# Altium schematic sheet ADC.SchDoc
size A4
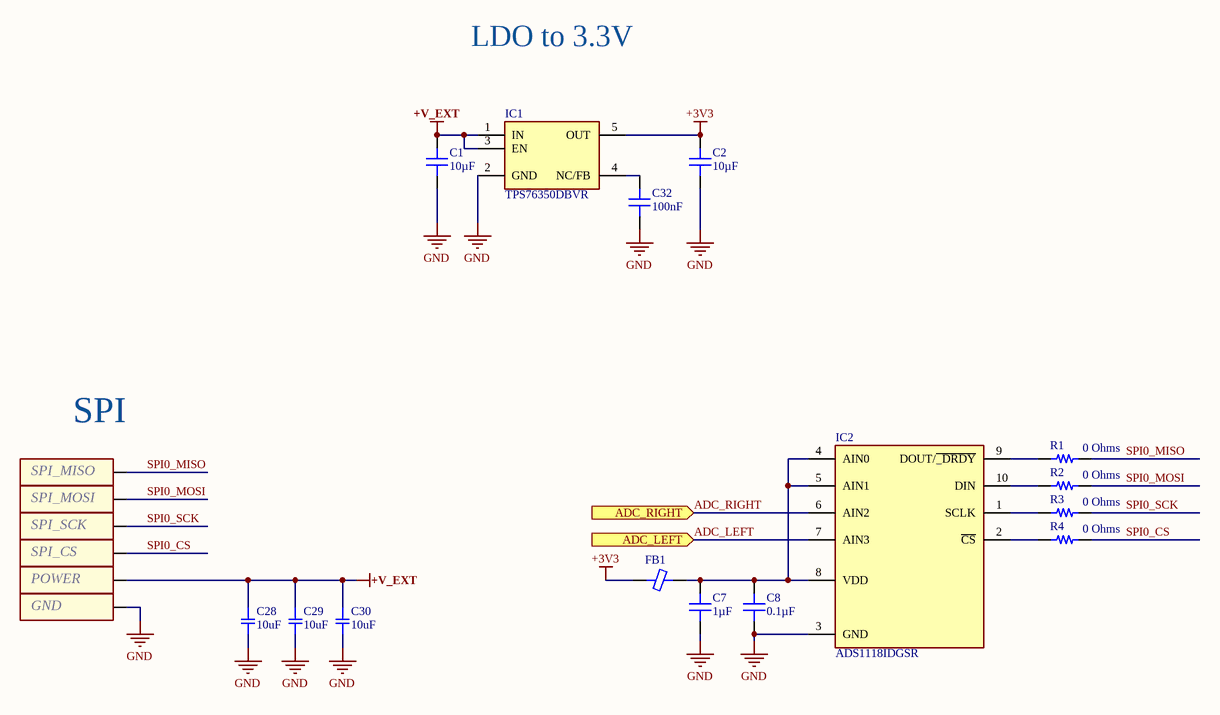
[diagram p0: ADC.SchDoc]

## Parts
C1  10µF  [CAP 0603_1608]
C2  10µF  [CAP 0603_1608]
C7  1µF  [CAP 0603_1608]
C8  0.1µF  [CAP 0603_1608]
C28  10uF  [SMD-0805C]
C29  10uF  [SMD-0805C]
C30  10uF  [SMD-0805C]
C32  100nF  [CAP 0603_1608]
FB1  (no value)  [FER 0603_1608]
IC1  TPS76350DBVR  [SOT95P280X145-5N]
IC2  ADS1118IDGSR  [SOP50P490X110-10N]
R1  0 Ohms  [RES 0603_1608]
R2  0 Ohms  [RES 0603_1608]
R3  0 Ohms  [RES 0603_1608]
R4  0 Ohms  [RES 0603_1608]
X1  SPI_MISO  [PLS-1]  (no BOM)
X2  Name: SPI_MOSI  [PLS-1]  (hidden comment: SPI_MISO)  (no BOM)
X3  Name: SPI_SCK  [PLS-1]  (hidden comment: SPI_MISO)  (no BOM)
X4  Name: SPI_CS  [PLS-1]  (hidden comment: SPI_MISO)  (no BOM)
X5  Name: POWER  [PLS-1]  (hidden comment: SPI_MISO)  (no BOM)
X6  Name: GND  [PLS-1]  (hidden comment: SPI_MISO)  (no BOM)

## Ports
ADC_LEFT (in), ADC_RIGHT (in)

## Nets
+3V3: C2.2 FB1.1 IC1.5(OUT)
+V_EXT: C1.2 C28.1 C29.1 C30.1 IC1.1(IN) IC1.3(EN) X5.1
GND: C1.1 C2.1 C7.1 C8.1 C28.2 C29.2 C30.2 C32.1 IC1.2(GND) IC2.3(GND) X6.1
ADC_LEFT: IC2.7(AIN3) ; port ADC_LEFT
ADC_RIGHT: IC2.6(AIN2) ; port ADC_RIGHT
SPI0_CS: R4.1 X4.1
SPI0_MISO: R1.1 X1.1
SPI0_MOSI: R2.1 X2.1
SPI0_SCK: R3.1 X3.1
NetC7_2: C7.2 C8.2 FB1.2 IC2.4(AIN0) IC2.5(AIN1) IC2.8(VDD)
NetC32_2: C32.2 IC1.4(NC/FB)
NetIC2_1: IC2.1(SCLK) R3.2
NetIC2_2: IC2.2(~{CS}) R4.2
NetIC2_9: IC2.9(DOUT/~{_DRDY}) R1.2
NetIC2_10: IC2.10(DIN) R2.2

## Notes on the sheet
- LDO to 3.3V
- (near X1) SPI
- Title
- Size:
- Date:
- A4
- Number:
- Time:
- Revision:
- Sheet
- of
- File:

## Library data of the parts
C1 C2 C7 C8 C32 = 100X14W104MV4T: CAP CER 0.1UF 10V X7R 0603; Part Number: 100X14W104MV4T
  C1 C2: Value: 10µF
  C7: Value: 1µF
  C8: Value: 0.1µF
  C32: Value: 100nF
C28-C30 = GRJ21BR71A106KE01L: CAP CER 10UF 10V X7R 0805; Manufacturer: Murata Electronics North America; Factory Stock: 0; Unit Price (USD): 0,69; Minimum Quantity: 1; Tolerance: ±10%; Part Number: GRJ21BR71A106KE01L; Datasheets: http://www.murata.com/~/media/webrenewal/support/library/catalog/products/capacitor/mlcc/c02e.pdf; Image: //media.digikey.com/Renders/Murata%20Renders/0805%20(2012%20Metric)%20.85mm.jpg; Digi-Key Part Number: 490-10919-1-ND; Quantity Available: 6658; @ qty: 0; Packaging: Cut Tape (CT); Series: GRJ; Part Status: Active; Value: 10uF; Voltage: 10V; Temperature Coefficient: X7R; Operating Temperature: -55°C ~ 125°C; Features: Soft Termination; Ratings: -; Applications: Boardflex Sensitive; Mounting Type: Surface Mount, MLCC; Package / Case: 0805 (2012 Metric); Size / Dimension: 0.079" L x 0.049" W (2.00mm x 1.25mm); Height - Seated (Max): -; Thickness (Max): 0.057" (1.45mm); Lead Spacing: -; Lead Style: -
FB1 = 2506031217H0: FERRITE BEAD 0603 1LN; Part Number: 2506031217H0
IC1 = TPS76350DBVR: Integrated Circuit; Manufacturer_Name: Texas Instruments; Datasheet Link: https://www.ti.com/lit/gpn/TPS763; Height: 1.45mm; Manufacturer_Part_Number: TPS76350DBVR; Mouser Part Number: 595-TPS76350DBVR; Mouser Price/Stock: https://www.mouser.co.uk/ProductDetail/Texas-Instruments/TPS76350DBVR?qs=8yeEWhuAOtMYKUfRRdAKSw%3D%3D; Arrow Part Number: TPS76350DBVR; Arrow Price/Stock: https://www.arrow.com/en/products/tps76350dbvr/texas-instruments
IC2 = ADS1118IDGSR: Integrated Circuit; Manufacturer_Name: Texas Instruments; Datasheet Link: http://www.ti.com/lit/gpn/ads1118; Height: 1.1mm; Manufacturer_Part_Number: ADS1118IDGSR; Mouser Part Number: 595-ADS1118IDGSR; Mouser Price/Stock: https://www.mouser.co.uk/ProductDetail/Texas-Instruments/ADS1118IDGSR?qs=g5raLcSarOb4n6jVZI8bUw%3D%3D; Arrow Part Number: ADS1118IDGSR; Arrow Price/Stock: https://www.arrow.com/en/products/ads1118idgsr/texas-instruments?region=nac
R1-R4 = RNCS0603BKE100R: RES 100 OHM 0.1% 1/16W 0603; Part Number: RNCS0603BKE100R; Value: 0 Ohms
X1-X6 = IN-OUT pin: Manufacturer: KHADB; ID: IN-OUT pin
  X1: Name: SPI_MISO